# Altium schematic sheet BuckLedDriver.SchDoc
size A4; SheetNumber: 1; SheetTotal: 1
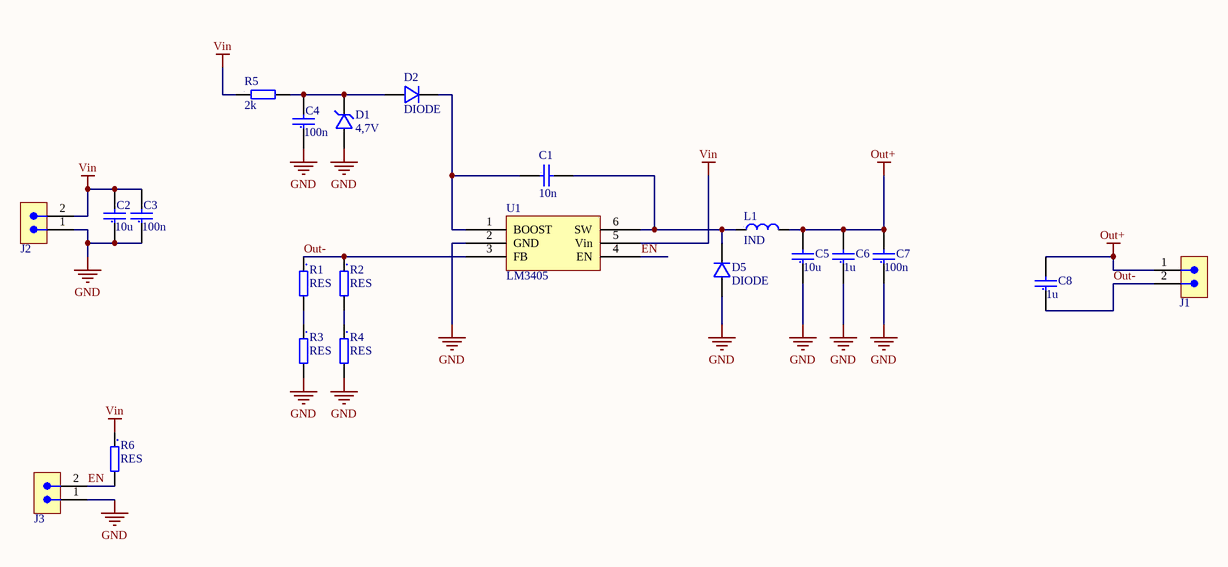
[diagram p0: BuckLedDriver.SchDoc]

## Parts
C1  10n  [C0402_N]
C2  10u  [C0603_N]
C3  100n  [C0402_N]
C4  100n  [C0402_N]
C5  10u  [C0603_N]
C6  1u  [C0402_N]
C7  100n  [C0402_N]
C8  1u  [C0603_N]
D1  4,7V  [SOD-323]
D2  DIODE  [SOD-323]
D5  DIODE  [SOD-323]
J1  (no value)  [B2B-XH-A]
J2  (no value)  [B2B-XH-A]
J3  (no value)  [B2B-XH-A]
L1  IND  [IHLP2020]
R1  RES  [R0805_N]
R2  RES  [R0805_N]
R3  RES  [R0805_N]
R4  RES  [R0805_N]
R5  2k  [R0603_N]
R6  RES  [R0402_N]
U1  LM3405  [SOT23-6]

## Nets
GND: C2.1 C3.1 C4.1 C5.1 C6.1 C7.1 D1.A D5.A J2.1 J3.1 R3.2 R4.2 U1.2(GND)
Out+: C5.2 C6.2 C7.2 C8.2 J1.1 L1.2
Vin: C2.2 C3.2 J2.2 R5.1 R6.1 U1.5(Vin)
EN: J3.2 R6.2 U1.4(EN)
Out-: C8.1 J1.2 R1.1 R2.1 U1.3(FB)
NetC1_1: C1.1 D2.C U1.1(BOOST)
NetC1_2: C1.2 D5.C L1.1 U1.6(SW)
NetC4_2: C4.2 D1.C D2.A R5.2
NetR1_2: R1.2 R3.1
NetR2_2: R2.2 R4.1

## Library data of the parts
C1-C8 = CAP: RevS: $Rev:: 58        $
D1 = DIODE_ZENER
J1-J3 = PINHDR_2X1: Socket; ComponentLink1Description: Manufacturer; ComponentLink1URL: http://www.we-online.de; ComponentLink2Description: Datasheet; ComponentLink2URL: http://katalog.we-online.de/em/datasheet/691412320002.pdf
L1 = IND: Inductor
R5 = RES
U1 = LM3405: 1.6-MHz, 1-A Constant Current Buck LED Driver